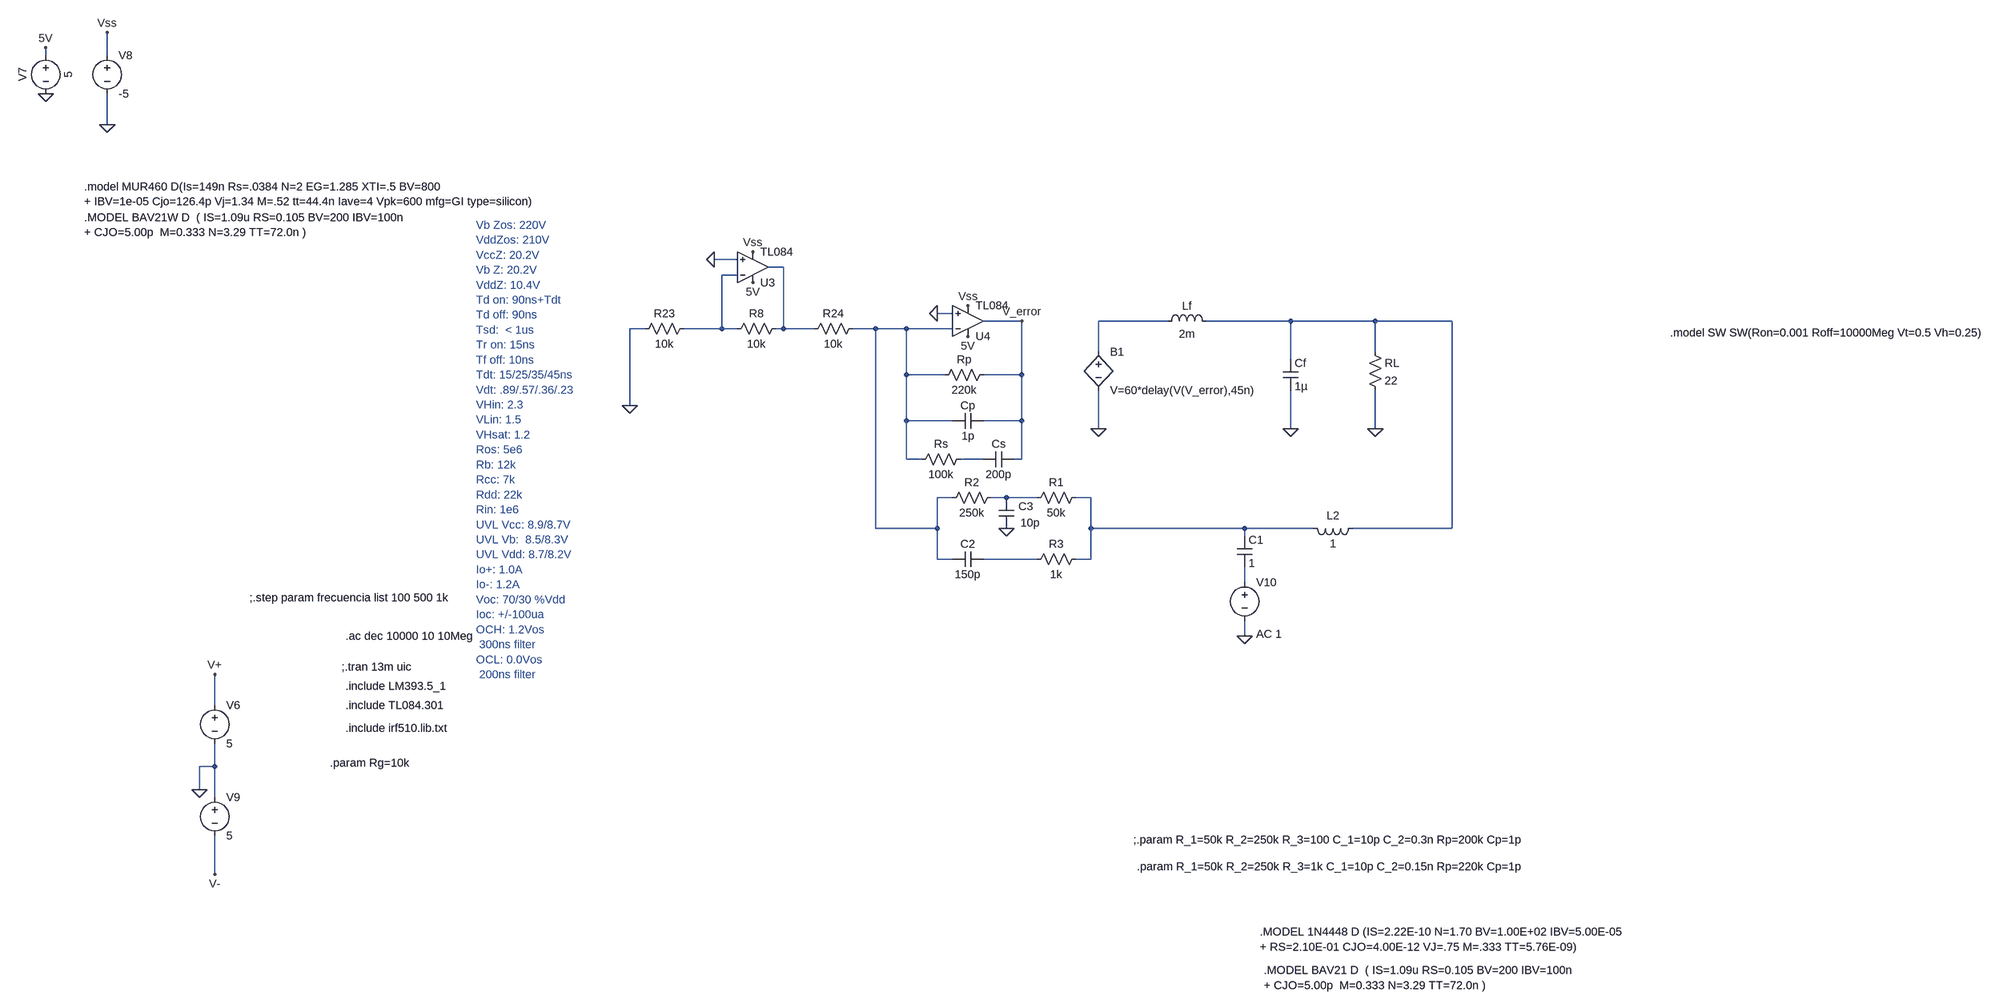
[diagram p0: schematic bode_completo.asc]
bode_completo.asc, the LTspice schematic file:
Version 4
SHEET 1 3216 2012
WIRE -2656 -448 -2656 -464
WIRE -2528 -448 -2528 -496
WIRE -2528 -304 -2528 -368
WIRE -1216 -16 -1264 -16
WIRE -1120 0 -1152 0
WIRE -1216 16 -1248 16
WIRE -768 96 -800 96
WIRE -624 112 -704 112
WIRE -320 112 -464 112
WIRE -64 112 -240 112
WIRE 112 112 -64 112
WIRE 272 112 112 112
WIRE -1408 128 -1440 128
WIRE -1248 128 -1248 16
WIRE -1248 128 -1328 128
WIRE -1216 128 -1248 128
WIRE -1120 128 -1120 0
WIRE -1120 128 -1136 128
WIRE -1056 128 -1120 128
WIRE -928 128 -976 128
WIRE -864 128 -928 128
WIRE -768 128 -864 128
WIRE -464 176 -464 112
WIRE 112 176 112 112
WIRE -64 192 -64 112
WIRE -864 224 -864 128
WIRE -784 224 -864 224
WIRE -624 224 -624 112
WIRE -624 224 -704 224
WIRE -1440 288 -1440 128
WIRE -864 320 -864 224
WIRE -768 320 -864 320
WIRE -624 320 -624 224
WIRE -624 320 -704 320
WIRE -464 336 -464 256
WIRE -64 336 -64 256
WIRE 112 336 112 256
WIRE -864 400 -864 320
WIRE -832 400 -864 400
WIRE -704 400 -752 400
WIRE -624 400 -624 320
WIRE -624 400 -640 400
WIRE -768 480 -800 480
WIRE -656 480 -688 480
WIRE -592 480 -656 480
WIRE -480 480 -512 480
WIRE -928 544 -928 128
WIRE -800 544 -800 480
WIRE -800 544 -928 544
WIRE -480 544 -480 480
WIRE -160 544 -480 544
WIRE -16 544 -160 544
WIRE 272 544 272 112
WIRE 272 544 64 544
WIRE -160 560 -160 544
WIRE -800 608 -800 544
WIRE -768 608 -800 608
WIRE -592 608 -704 608
WIRE -480 608 -480 544
WIRE -480 608 -512 608
WIRE -160 656 -160 624
WIRE -160 768 -160 736
WIRE -2304 912 -2304 848
WIRE -2304 1040 -2304 992
WIRE -2304 1040 -2336 1040
WIRE -2336 1088 -2336 1040
WIRE -2304 1104 -2304 1040
WIRE -2304 1264 -2304 1184
FLAG -2656 -368 0
FLAG -2528 -304 0
FLAG -2528 -496 Vss
FLAG -2656 -464 5V
FLAG -656 544 0
FLAG -624 112 V_error
FLAG -736 80 Vss
FLAG -736 144 5V
FLAG -1264 -16 0
FLAG -1184 -32 Vss
FLAG -1184 32 5V
FLAG -800 96 0
FLAG -1440 288 0
FLAG -2336 1088 0
FLAG -2304 848 V+
FLAG -2304 1264 V-
FLAG -160 768 0
FLAG -464 336 0
FLAG -64 336 0
FLAG 112 336 0
SYMBOL voltage -2656 -464 R0
WINDOW 0 -32 56 VBottom 2
WINDOW 3 32 56 VTop 2
WINDOW 123 0 0 Left 2
WINDOW 39 0 0 Left 2
SYMATTR InstName V7
SYMATTR Value 5
SYMBOL voltage -2528 -464 R0
WINDOW 123 0 0 Left 2
WINDOW 39 0 0 Left 2
SYMATTR InstName V8
SYMATTR Value -5
SYMBOL res -672 464 R90
WINDOW 0 0 56 VBottom 2
WINDOW 3 32 56 VTop 2
SYMATTR InstName R2
SYMATTR Value 250k
SYMBOL res -496 464 R90
WINDOW 0 0 56 VBottom 2
WINDOW 3 32 56 VTop 2
SYMATTR InstName R1
SYMATTR Value 50k
SYMBOL cap -640 544 R180
WINDOW 0 -40 46 Left 2
WINDOW 3 -54 12 Left 2
SYMATTR InstName C3
SYMATTR Value 10p
SYMBOL cap -704 592 R90
WINDOW 0 0 32 VBottom 2
WINDOW 3 32 32 VTop 2
SYMATTR InstName C2
SYMATTR Value 150p
SYMBOL res -496 592 R90
WINDOW 0 0 56 VBottom 2
WINDOW 3 32 56 VTop 2
SYMATTR InstName R3
SYMATTR Value 1k
SYMBOL res -688 208 R90
WINDOW 0 0 56 VBottom 2
WINDOW 3 32 56 VTop 2
SYMATTR InstName Rp
SYMATTR Value 220k
SYMBOL cap -704 304 R90
WINDOW 0 0 32 VBottom 2
WINDOW 3 32 32 VTop 2
SYMATTR InstName Cp
SYMATTR Value 1p
SYMBOL opamp2 -736 176 M180
SYMATTR InstName U4
SYMATTR Value TL084
SYMBOL res -1120 112 R90
WINDOW 0 0 56 VBottom 2
WINDOW 3 32 56 VTop 2
SYMATTR InstName R8
SYMATTR Value 10k
SYMBOL res -1312 112 R90
WINDOW 0 0 56 VBottom 2
WINDOW 3 32 56 VTop 2
SYMATTR InstName R23
SYMATTR Value 10k
SYMBOL res -960 112 R90
WINDOW 0 0 56 VBottom 2
WINDOW 3 32 56 VTop 2
SYMATTR InstName R24
SYMATTR Value 10k
SYMBOL opamp2 -1184 64 M180
SYMATTR InstName U3
SYMATTR Value TL084
SYMBOL voltage -2304 896 R0
WINDOW 123 0 0 Left 2
WINDOW 39 0 0 Left 2
SYMATTR InstName V6
SYMATTR Value 5
SYMBOL voltage -2304 1088 R0
WINDOW 123 0 0 Left 2
WINDOW 39 0 0 Left 2
SYMATTR InstName V9
SYMATTR Value 5
SYMBOL res 96 160 R0
SYMATTR InstName RL
SYMATTR Value 22
SYMBOL ind 80 528 R90
WINDOW 0 5 56 VBottom 2
WINDOW 3 32 56 VTop 2
SYMATTR InstName L2
SYMATTR Value 1
SYMBOL cap -176 560 R0
SYMATTR InstName C1
SYMATTR Value 1
SYMBOL voltage -160 640 R0
WINDOW 123 24 124 Left 2
WINDOW 39 0 0 Left 2
SYMATTR Value2 AC 1
SYMATTR InstName V10
SYMATTR Value ""
SYMBOL bv -464 160 R0
SYMATTR InstName B1
SYMATTR Value V=60*delay(V(V_error),45n)
SYMBOL ind -336 128 R270
WINDOW 0 32 56 VTop 2
WINDOW 3 5 56 VBottom 2
SYMATTR InstName Lf
SYMATTR Value 2m
SYMBOL cap -80 192 R0
SYMATTR InstName Cf
SYMATTR Value 1µ
SYMBOL res -736 384 R90
WINDOW 0 0 56 VBottom 2
WINDOW 3 32 56 VTop 2
SYMATTR InstName Rs
SYMATTR Value 100k
SYMBOL cap -640 384 R90
WINDOW 0 0 32 VBottom 2
WINDOW 3 32 32 VTop 2
SYMATTR InstName Cs
SYMATTR Value 200p
TEXT -1760 -88 Left 2 ;Vb Zos: 220V\nVddZos: 210V\nVccZ: 20.2V\nVb Z: 20.2V\nVddZ: 10.4V\nTd on: 90ns+Tdt\nTd off: 90ns\nTsd:  < 1us\nTr on: 15ns\nTf off: 10ns\nTdt: 15/25/35/45ns\nVdt: .89/.57/.36/.23\nVHin: 2.3\nVLin: 1.5\nVHsat: 1.2\nRos: 5e6\nRb: 12k\nRcc: 7k\nRdd: 22k\nRin: 1e6\nUVL Vcc: 8.9/8.7V\nUVL Vb:  8.5/8.3V\nUVL Vdd: 8.7/8.2V\nIo+: 1.0A\nIo-: 1.2A\nVoc: 70/30 %Vdd\nIoc: +/-100ua\nOCH: 1.2Vos\n 300ns filter\nOCL: 0.0Vos\n 200ns filter
TEXT -2040 832 Left 2 !;.tran 13m uic
TEXT -2576 -168 Left 2 !.model MUR460 D(Is=149n Rs=.0384 N=2 EG=1.285 XTI=.5 BV=800 \n+ IBV=1e-05 Cjo=126.4p Vj=1.34 M=.52 tt=44.4n Iave=4 Vpk=600 mfg=GI type=silicon)
TEXT -2576 -104 Left 2 !.MODEL BAV21W D  ( IS=1.09u RS=0.105 BV=200 IBV=100n\n+ CJO=5.00p  M=0.333 N=3.29 TT=72.0n )
TEXT -2032 872 Left 2 !.include LM393.5_1
TEXT -2032 912 Left 2 !.include TL084.301
TEXT -2064 1032 Left 2 !.param Rg=10k
TEXT -392 1192 Left 2 !;.param R_1=50k R_2=250k R_3=100 C_1=10p C_2=0.3n Rp=200k Cp=1p
TEXT 1816 136 Left 2 !.model SW SW(Ron=0.001 Roff=10000Meg Vt=0.5 Vh=0.25)
TEXT -120 1464 Left 2 !.MODEL BAV21 D  ( IS=1.09u RS=0.105 BV=200 IBV=100n\n+ CJO=5.00p  M=0.333 N=3.29 TT=72.0n )
TEXT -128 1384 Left 2 !.MODEL 1N4448 D (IS=2.22E-10 N=1.70 BV=1.00E+02 IBV=5.00E-05\n+ RS=2.10E-01 CJO=4.00E-12 VJ=.75 M=.333 TT=5.76E-09)
TEXT -2032 960 Left 2 !.include irf510.lib.txt
TEXT -2232 688 Left 2 !;.step param frecuencia list 100 500 1k
TEXT -384 1248 Left 2 !.param R_1=50k R_2=250k R_3=1k C_1=10p C_2=0.15n Rp=220k Cp=1p
TEXT -2032 768 Left 2 !.ac dec 10000 10 10Meg

The netlist it stands for:
* bode_completo.asc
V7 5V 0 5
V8 Vss 0 -5
R2 N007 N005 250k
R1 N008 N007 50k
C3 0 N007 10p
C2 N009 N005 150p
R3 N008 N009 1k
Rp V_error N005 220k
Cp V_error N005 1p
XU4 0 N005 5V Vss V_error TL084  ; pins In+ In- V+ V- OUT
R8 N001 N002 10k
R23 N002 0 10k
R24 N005 N001 10k
XU3 0 N002 5V Vss N001 TL084  ; pins In+ In- V+ V- OUT
V6 V+ 0 5
V9 0 V- 5
RL N004 0 22
L2 N004 N008 1
C1 N008 N010 1
V10 N010 0 AC 1
B1 N003 0 V=60*delay(V(V_error),45n)
Lf N003 N004 2m
Cf N004 0 1µ
Rs N006 N005 100k
Cs V_error N006 200p
* Vb Zos: 220V
* VddZos: 210V
* VccZ: 20.2V
* Vb Z: 20.2V
* VddZ: 10.4V
* Td on: 90ns+Tdt
* Td off: 90ns
* Tsd:  < 1us
* Tr on: 15ns
* Tf off: 10ns
* Tdt: 15/25/35/45ns
* Vdt: .89/.57/.36/.23
* VHin: 2.3
* VLin: 1.5
* VHsat: 1.2
* Ros: 5e6
* Rb: 12k
* Rcc: 7k
* Rdd: 22k
* Rin: 1e6
* UVL Vcc: 8.9/8.7V
* UVL Vb:  8.5/8.3V
* UVL Vdd: 8.7/8.2V
* Io+: 1.0A
* Io-: 1.2A
* Voc: 70/30 %Vdd
* Ioc: +/-100ua
* OCH: 1.2Vos
*  300ns filter
* OCL: 0.0Vos
*  200ns filter
;.tran 13m uic
.model MUR460 D(Is=149n Rs=.0384 N=2 EG=1.285 XTI=.5 BV=800
+ IBV=1e-05 Cjo=126.4p Vj=1.34 M=.52 tt=44.4n Iave=4 Vpk=600 mfg=GI type=silicon)
.MODEL BAV21W D  ( IS=1.09u RS=0.105 BV=200 IBV=100n
+ CJO=5.00p  M=0.333 N=3.29 TT=72.0n )
.include LM393.5_1
.include TL084.301
.param Rg=10k
;.param R_1=50k R_2=250k R_3=100 C_1=10p C_2=0.3n Rp=200k Cp=1p
.model SW SW(Ron=0.001 Roff=10000Meg Vt=0.5 Vh=0.25)
.MODEL BAV21 D  ( IS=1.09u RS=0.105 BV=200 IBV=100n
+ CJO=5.00p  M=0.333 N=3.29 TT=72.0n )
.MODEL 1N4448 D (IS=2.22E-10 N=1.70 BV=1.00E+02 IBV=5.00E-05
+ RS=2.10E-01 CJO=4.00E-12 VJ=.75 M=.333 TT=5.76E-09)
.include irf510.lib.txt
;.step param frecuencia list 100 500 1k
.param R_1=50k R_2=250k R_3=1k C_1=10p C_2=0.15n Rp=220k Cp=1p
.ac dec 10000 10 10Meg
.backanno
.end